# Altium schematic sheet CAN.SchDoc
size A4
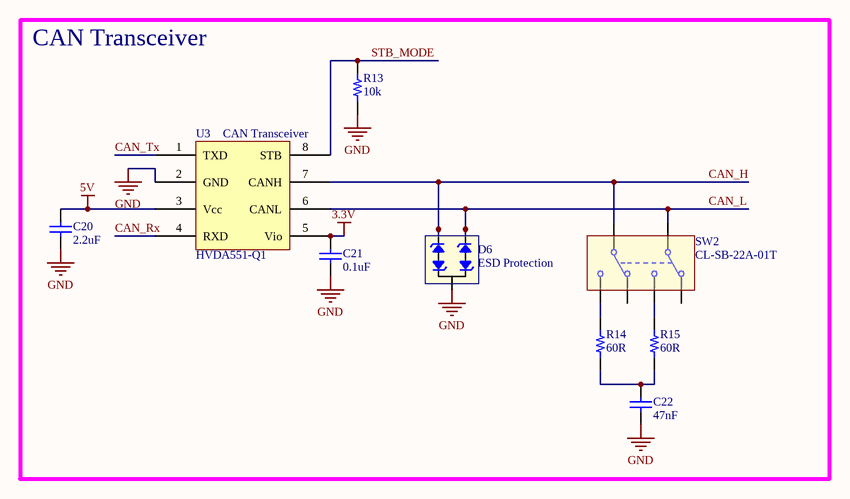
[diagram p0: CAN.SchDoc]

## Parts
C20  value 2.2uF  [C0603]  (hidden comment: CAP CER 0603 2.2uF 6.3V X7R 10%)
C21  value 0.1uF  [C0603]  (hidden comment: CAP CER 0603 0.1uF 50V C0G 10%)
C22  value 47nF  [C0603]  (hidden comment: CAP CER 0603 47nF 50V X7R 10%)
D6  ESD Protection  [SOT323]
R13  value 10k  [R0603]  (hidden comment: RES 0603 10k 1% 0.1W)
R14  value 60R  [R0603]  (hidden comment: RES 0603 60R 1% 0.25W)
R15  value 60R  [R0603]  (hidden comment: RES 0603 60R 1% 0.25W)
SW2  CL-SB-22A-01T  [CL-SB-22A-01T]
U3  CAN Transceiver  [SOIC-8]

## Blocks framed on the sheet
CAN Transceiver: C20-C22 D6 R13-R15 SW2 U3

## Nets
3.3V: C21.2 U3.5(Vio)
5V: C20.2 U3.3(Vcc)
GND: C20.1 C21.1 C22.2 D6.3 R13.1 U3.2(GND)
CAN_H: D6.2 SW2.5(COMMON2) U3.7(CANH)
CAN_L: D6.1 SW2.2(COMMON1) U3.6(CANL)
CAN_Rx: U3.4(RXD)
CAN_Tx: U3.1(TXD)
STB_MODE: R13.2 U3.8(STB)
NetC22_1: C22.1 R14.1 R15.1
NetR14_2: R14.2 SW2.6(NO2)
NetR15_2: R15.2 SW2.3(NO1)

Not connected (* = marked no-connect by the designer): SW2 1(NC1) 4(NC2)

## Library data of the parts
C20 = CAP CER 0603 2.2uF 6.3V X7R 10%: 2.2uF ceramic capacitor; Manufacturer: TDK Corporation; Part_Number: CGA3E1X7R0J225K080AC; Tolerance: 10%; Voltage rating: 6.3V; Price: 0.34; Supplier_Link: http://www.digikey.ca/product-detail/en/CGA3E1X7R0J225K080AC/445-6933-1-ND/2672951; Supplier 1: Digi-Key; Supplier Part Number 1: 445-6933-1-ND
C21 = CAP CER 0603 0.1uF 50V C0G 10%: 0.1uF ceramic capacitor; Manufacturer: Murata Electronics North America; Part_Number: GCM188R71H104KA57D; Tolerance: 10%; Voltage rating: 50V; Supplier_Link: https://www.digikey.ca/product-detail/en/murata-electronics-north-america/GCM188R71H104KA57D/490-4779-1-ND/1641698; Price: 0.45; Supplier 1: Digi-Key; Supplier Part Number 1: 490-4779-1-ND
C22 = CAP CER 0603 47nF 50V X7R 10%: 47nF ceramic capacitor; Manufacturer: Murata Electronics North America; Part_Number: GCJ188R71H473KA12D; Tolerance: 10%; Voltage rating: 50V; Price: 0.45; Supplier_Link: https://www.digikey.ca/product-detail/en/murata-electronics-north-america/GCJ188R71H473KA12D/490-5854-1-ND/2785840; Supplier 1: Digi-Key; Supplier Part Number 1: 490-5854-1-ND
D6 = PESD1CAN-UX: CAN bus ESD protection diode; Manufacturer: NXP; Part_Number: PESD1CAN-UX; Price: 0.51; Supplier_Link: http://www.digikey.ca/product-detail/en/nxp-semiconductors/PESD1CAN-UX/568-10731-1-ND/4386316; Price_10: 0.417; Supplier 1: Digi-Key; Supplier Part Number 1: 568-10731-2-ND
R13 = RES 0603 10k 1% 0.1W: 10 kOhms 1% 0.1W Resistor; Manufacturer: Panasonic Electronic Components; Part_Number: ERJ-3EKF1002V; Supplier_Link: https://www.digikey.ca/product-detail/en/panasonic-electronic-components/ERJ-3EKF1002V/P10.0KHCT-ND/198102; Power: 0.1W; Price_10: 0.095; Tolerance: 1%; Supplier 1: Digi-Key; Supplier Part Number 1: P10.0KHCT-ND
R14 R15 = RES 0603 60R 1% 0.25W: 60 Ohms 0.25W Resistor; Part_Number: ESR03EZPJ620; Manufacturer: Rohm Semiconductor; Tolerance: 5%; Price: 0.15; Supplier_Link: http://www.digikey.ca/product-detail/en/ESR03EZPJ620/RHM62DCT-ND/1983794; Power: 0.25W; Supplier 1: Digi-Key; Supplier Part Number 1: RHM62DCT-ND
SW2 = CL-SB-22A-01T: SWITCH SLIDE DPDT 200MA 12VDC; Manufacturer: Copal Electronics Inc.; Supplier_Link: http://www.digikey.ca/product-detail/en/copal-electronics-inc/CL-SB-22A-01T/563-1338-1-ND/3507893; Price: 1.4; Price_10: 1.347; Supplier 1: Digi-Key; Supplier Part Number 1: 563-1338-1-ND; Part_Number: CL-SB-22A-01T
U3 = HVDA551-Q1: Automotive 5-V CAN Transceiver with I/O Level Adapting and Low-Power Mode Supply Optimization; Manufacturer: Texas Instrument; Supplier 1: Digi-Key; Supplier Part Number 1: 296-40116-1-ND; Supplier_Link: http://www.digikey.ca/product-detail/en/HVDA551QDRQ1/296-40116-1-ND/5177993; Part_Number: HVDA551-Q1; Sample_Link: http://www.ti.com/product/HVDA551-Q1/samplebuy; Price: 2.450; Price_10: 2.201